# Altium project Cubesat_PDM.PrjPcb (part 1 of 3)
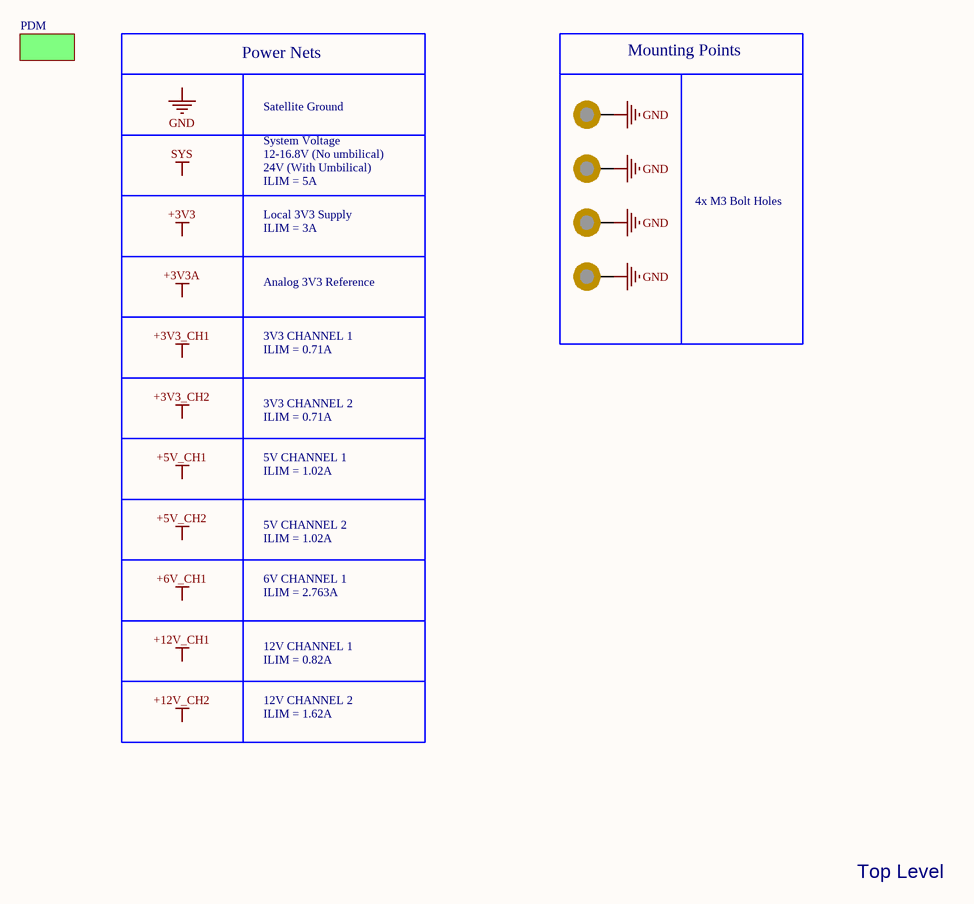
[diagram p0: Top_Level.SchDoc]
Engineer: TH; Engineer_Name: TH; PCB_Name: PDM; Revision: 1
11 sheets, 331 parts. Net scope: flat (ports and power ports of the same name join across sheets).
Board file: PDM.PcbDoc
Sheets:
  Top_Level.SchDoc
    PDM = PDM.SchDoc
      Controller = Controller.SchDoc
        I2C_Buffer = I2C_Buffer.SchDoc
      12V_Supply = 12V_Supply.SchDoc
      3V3_Supply = 3V3_Supply.SchDoc
      5V5_Supply = 6V_Supply.SchDoc
      Ideal_Diode0 = Ideal_Diode.SchDoc
      Ideal_Diode1 = Ideal_Diode.SchDoc
      Ideal_Diode2 = Ideal_Diode.SchDoc
      Ideal_Diode3 = Ideal_Diode.SchDoc
      5V_Supply = 5V_Supply.SchDoc
      Heater_1 = Heater_Driver.SchDoc
      Heater_2 = Heater_Driver.SchDoc
      PC104 = PC104.SchDoc

## Sheet Top_Level.SchDoc
size 297 x 209 mm; SheetNumber: 1; SheetTotal: 11

### Parts
MECH1  M3 Mounting Hole  [M3 Mounting Hole]  (value not drawn)  (no BOM)
MECH2  M3 Mounting Hole  [M3 Mounting Hole]  (value not drawn)  (no BOM)
MECH3  M3 Mounting Hole  [M3 Mounting Hole]  (value not drawn)  (no BOM)
MECH4  M3 Mounting Hole  [M3 Mounting Hole]  (value not drawn)  (no BOM)

### Sub-sheets
PDM = PDM: no entries

### Nets
GND: MECH1.1 MECH2.1 MECH3.1 MECH4.1

### Notes on the sheet
- Power Nets
- Mounting Points
- Satellite Ground
- System Voltage
- 12-16.8V (No umbilical)
- 24V (With Umbilical)
- ILIM = 5A
- Local 3V3 Supply
- ILIM = 3A
- 4x M3 Bolt Holes
- Analog 3V3 Reference
- 3V3 CHANNEL 1
- ILIM = 0.71A
- 3V3 CHANNEL 2
- 5V CHANNEL 1
- ILIM = 1.02A
- 5V CHANNEL 2
- 6V CHANNEL 1
- ILIM = 2.763A
- 12V CHANNEL 1
- ILIM = 0.82A
- 12V CHANNEL 2
- ILIM = 1.62A
- Top Level
- Labels drawn without touching a wire or pin: +3V3, +3V3_CH1, +3V3_CH2, +3V3A, +5V_CH1, +5V_CH2, +6V_CH1, +12V_CH1, +12V_CH2, GND, SYS
- Size:
- Title:
- A4
- Project:
- Rev:
- Date:
- Drawn By:
- Sheet:
- of

## Sheet PDM.SchDoc
size 297 x 209 mm; SheetNumber: 2; SheetTotal: 11
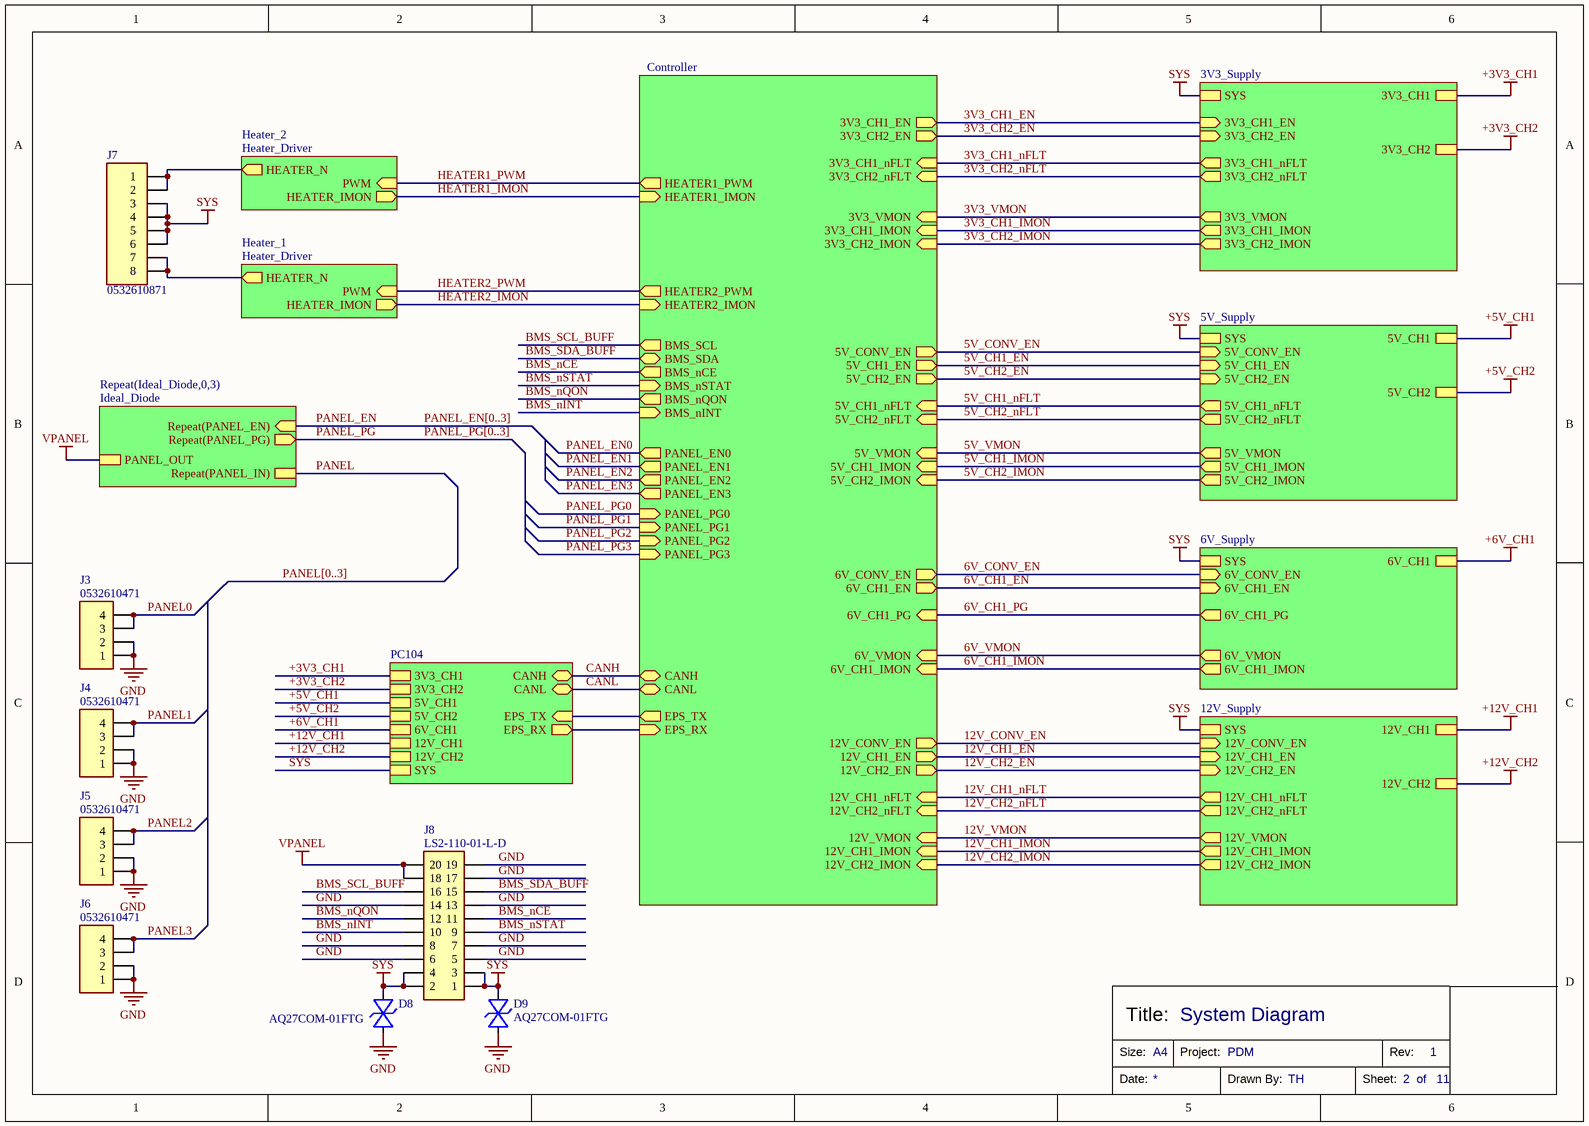
[diagram p1: PDM.SchDoc]

### Parts
D8  AQ27COM-01FTG  [SOD-323]
D9  AQ27COM-01FTG  [SOD-323]
J3  0532610471  [0532610471]
J4  0532610471  [0532610471]
J5  0532610471  [0532610471]
J6  0532610471  [0532610471]
J7  0532610871  [0532610871]
J8  LS2-110-01-L-D  [LS2-110-01-L-D]

### Sub-sheets
3V3_Supply = 3V3_Supply: SYS, 3V3_CH1, 3V3_CH2, 3V3_CH1_EN (in), 3V3_CH2_EN (in), 3V3_CH1_nFLT (out), 3V3_CH2_nFLT (out), 3V3_VMON (out), 3V3_CH1_IMON (out), 3V3_CH2_IMON (out)
5V5_Supply = 6V_Supply: SYS, 6V_CH1, 6V_CONV_EN (in), 6V_CH1_EN (in), 6V_CH1_PG (out), 6V_VMON (out), 6V_CH1_IMON (out)
5V_Supply = 5V_Supply: SYS, 5V_CH1, 5V_CH2, 5V_CONV_EN (in), 5V_CH1_EN (in), 5V_CH2_EN (in), 5V_CH1_nFLT (out), 5V_CH2_nFLT (out), 5V_VMON (out), 5V_CH1_IMON (out), 5V_CH2_IMON (out)
12V_Supply = 12V_Supply: SYS, 12V_CH1, 12V_CH2, 12V_CONV_EN (in), 12V_CH1_EN (in), 12V_CH2_EN (in), 12V_CH1_nFLT (out), 12V_CH2_nFLT (out), 12V_VMON (out), 12V_CH1_IMON (out), 12V_CH2_IMON (out)
Controller = Controller: HEATER1_PWM (out), HEATER1_IMON (in), HEATER2_PWM (out), HEATER2_IMON (in), PANEL_EN3 (out), PANEL_EN2 (out), PANEL_EN1 (out), PANEL_EN0 (out), PANEL_PG0 (in), PANEL_PG1 (in), PANEL_PG2 (in), PANEL_PG3 (in), 3V3_CH1_EN (out), 3V3_CH2_EN (out), 3V3_CH1_nFLT (in), 3V3_CH2_nFLT (in), 3V3_VMON (in), 3V3_CH1_IMON (in), 3V3_CH2_IMON (in), 5V_CONV_EN (out), 5V_CH1_EN (out), 5V_CH2_EN (out), 5V_CH1_nFLT (in), 5V_CH2_nFLT (in), 5V_CH1_IMON (in), 5V_CH2_IMON (in), 6V_CONV_EN (out), 6V_CH1_EN (out), 6V_CH1_PG (in), 6V_VMON (in), 12V_CONV_EN (out), 12V_CH1_EN (out), 12V_CH2_EN (out), 12V_CH1_nFLT (in), 12V_CH2_nFLT (in), 12V_VMON (in), 12V_CH1_IMON (in), 12V_CH2_IMON (in), 5V_VMON (in), 6V_CH1_IMON (in), BMS_SCL (out), BMS_SDA (bidir), BMS_nSTAT (in), BMS_nCE (out), BMS_nQON (out), BMS_nINT (in), CANH (bidir), CANL (bidir), EPS_TX (out), EPS_RX (in)
Heater_1 = Heater_Driver: HEATER_N (out), PWM (in), HEATER_IMON (out)
Heater_2 = Heater_Driver: HEATER_N (out), PWM (in), HEATER_IMON (out)
PC104 = PC104: 3V3_CH1, 3V3_CH2, 5V_CH1, 5V_CH2, 6V_CH1, 12V_CH1, 12V_CH2, CANH (bidir), CANL (bidir), SYS, EPS_TX (in), EPS_RX (out)
Repeat(Ideal_Diode,0,3) = Ideal_Diode: Repeat(PANEL_IN), Repeat(PANEL_EN) (in), Repeat(PANEL_PG) (out), PANEL_OUT

### Nets
+3V3_CH1: sheet 3V3_Supply/3V3_CH1, sheet PC104/3V3_CH1
+3V3_CH2: sheet 3V3_Supply/3V3_CH2, sheet PC104/3V3_CH2
+5V_CH1: sheet 5V_Supply/5V_CH1, sheet PC104/5V_CH1
+5V_CH2: sheet 5V_Supply/5V_CH2, sheet PC104/5V_CH2
+6V_CH1: sheet 5V5_Supply/6V_CH1, sheet PC104/6V_CH1
+12V_CH1: sheet 12V_Supply/12V_CH1, sheet PC104/12V_CH1
+12V_CH2: sheet 12V_Supply/12V_CH2, sheet PC104/12V_CH2
GND: D8.A D9.A J3.1 J3.2 J4.1 J4.2 J5.1 J5.2 J6.1 J6.2 J8.5 J8.6 J8.7 J8.8 J8.13 J8.14 J8.17 J8.19
SYS: D8.K D9.K J7.3 J7.4 J7.5 J7.6 J8.1 J8.2 J8.3 J8.4 ; sheet 12V_Supply/SYS, sheet 3V3_Supply/SYS, sheet 5V5_Supply/SYS, sheet 5V_Supply/SYS, sheet PC104/SYS
VPANEL: J8.18 J8.20 ; sheet Repeat(Ideal_Diode,0,3)/PANEL_OUT
3V3_CH1_EN: sheet Controller/3V3_CH1_EN, sheet 3V3_Supply/3V3_CH1_EN
3V3_CH1_IMON: sheet Controller/3V3_CH1_IMON, sheet 3V3_Supply/3V3_CH1_IMON
3V3_CH1_nFLT: sheet Controller/3V3_CH1_nFLT, sheet 3V3_Supply/3V3_CH1_nFLT
3V3_CH2_EN: sheet Controller/3V3_CH2_EN, sheet 3V3_Supply/3V3_CH2_EN
3V3_CH2_IMON: sheet Controller/3V3_CH2_IMON, sheet 3V3_Supply/3V3_CH2_IMON
3V3_CH2_nFLT: sheet Controller/3V3_CH2_nFLT, sheet 3V3_Supply/3V3_CH2_nFLT
3V3_VMON: sheet Controller/3V3_VMON, sheet 3V3_Supply/3V3_VMON
5V_CH1_EN: sheet Controller/5V_CH1_EN, sheet 5V_Supply/5V_CH1_EN
5V_CH1_IMON: sheet Controller/5V_CH1_IMON, sheet 5V_Supply/5V_CH1_IMON
5V_CH1_nFLT: sheet Controller/5V_CH1_nFLT, sheet 5V_Supply/5V_CH1_nFLT
5V_CH2_EN: sheet Controller/5V_CH2_EN, sheet 5V_Supply/5V_CH2_EN
5V_CH2_IMON: sheet Controller/5V_CH2_IMON, sheet 5V_Supply/5V_CH2_IMON
5V_CH2_nFLT: sheet Controller/5V_CH2_nFLT, sheet 5V_Supply/5V_CH2_nFLT
5V_CONV_EN: sheet Controller/5V_CONV_EN, sheet 5V_Supply/5V_CONV_EN
5V_VMON: sheet Controller/5V_VMON, sheet 5V_Supply/5V_VMON
6V_CH1_EN: sheet Controller/6V_CH1_EN, sheet 5V5_Supply/6V_CH1_EN
6V_CH1_IMON: sheet Controller/6V_CH1_IMON, sheet 5V5_Supply/6V_CH1_IMON
6V_CH1_PG: sheet Controller/6V_CH1_PG, sheet 5V5_Supply/6V_CH1_PG
6V_CONV_EN: sheet Controller/6V_CONV_EN, sheet 5V5_Supply/6V_CONV_EN
6V_VMON: sheet Controller/6V_VMON, sheet 5V5_Supply/6V_VMON
12V_CH1_EN: sheet Controller/12V_CH1_EN, sheet 12V_Supply/12V_CH1_EN
12V_CH1_IMON: sheet Controller/12V_CH1_IMON, sheet 12V_Supply/12V_CH1_IMON
12V_CH1_nFLT: sheet Controller/12V_CH1_nFLT, sheet 12V_Supply/12V_CH1_nFLT
12V_CH2_EN: sheet Controller/12V_CH2_EN, sheet 12V_Supply/12V_CH2_EN
12V_CH2_IMON: sheet Controller/12V_CH2_IMON, sheet 12V_Supply/12V_CH2_IMON
12V_CH2_nFLT: sheet Controller/12V_CH2_nFLT, sheet 12V_Supply/12V_CH2_nFLT
12V_CONV_EN: sheet Controller/12V_CONV_EN, sheet 12V_Supply/12V_CONV_EN
12V_VMON: sheet Controller/12V_VMON, sheet 12V_Supply/12V_VMON
BMS_nCE: J8.11 ; sheet Controller/BMS_nCE
BMS_nINT: J8.10 ; sheet Controller/BMS_nINT
BMS_nQON: J8.12 ; sheet Controller/BMS_nQON
BMS_nSTAT: J8.9 ; sheet Controller/BMS_nSTAT
BMS_SCL_BUFF: J8.16 ; sheet Controller/BMS_SCL
BMS_SDA_BUFF: J8.15 ; sheet Controller/BMS_SDA
CANH: sheet Controller/CANH, sheet PC104/CANH
CANL: sheet Controller/CANL, sheet PC104/CANL
HEATER1_IMON: sheet Controller/HEATER1_IMON, sheet Heater_2/HEATER_IMON
HEATER1_PWM: sheet Controller/HEATER1_PWM, sheet Heater_2/PWM
HEATER2_IMON: sheet Controller/HEATER2_IMON, sheet Heater_1/HEATER_IMON
HEATER2_PWM: sheet Controller/HEATER2_PWM, sheet Heater_1/PWM
PANEL: sheet Repeat(Ideal_Diode,0,3)/Repeat(PANEL_IN)
PANEL0: J3.3 J3.4
PANEL1: J4.3 J4.4
PANEL2: J5.3 J5.4
PANEL3: J6.3 J6.4
PANEL_EN: sheet Repeat(Ideal_Diode,0,3)/Repeat(PANEL_EN)
PANEL_EN0: sheet Controller/PANEL_EN0
PANEL_EN1: sheet Controller/PANEL_EN1
PANEL_EN2: sheet Controller/PANEL_EN2
PANEL_EN3: sheet Controller/PANEL_EN3
PANEL_PG: sheet Repeat(Ideal_Diode,0,3)/Repeat(PANEL_PG)
PANEL_PG0: sheet Controller/PANEL_PG0
PANEL_PG1: sheet Controller/PANEL_PG1
PANEL_PG2: sheet Controller/PANEL_PG2
PANEL_PG3: sheet Controller/PANEL_PG3
NetJ7_1: J7.1 J7.2 ; sheet Heater_2/HEATER_N
NetJ7_7: J7.7 J7.8 ; sheet Heater_1/HEATER_N
(unnamed): sheet Controller/EPS_TX, sheet PC104/EPS_TX
(unnamed): sheet Controller/EPS_RX, sheet PC104/EPS_RX

### Buses and harness runs
bus PANEL[0..3]
bus PANEL_EN[0..3]
bus PANEL_PG[0..3]

### Notes on the sheet
- System Diagram
- Size:
- Title:
- A4
- Project:
- Rev:
- Date:
- Drawn By:
- Sheet:
- of

### Library data of the parts
D8 D9 = AQ27COM-01FTG: Transient Voltage Suppression Diodes - TVS 27V 4A 30kV 12pF SOD323 Diode Array; Clamping Voltage: 50V; Breakdown Voltage: 28V; Vesd: 32kV; Working Voltage: 27V; Ipp - Peak Pulse Current: 4A; Temperature Range: -40~150°C; Part Number: AQ27COM-01FTG; Distributor: Digikey; Distributor Part Number: 18-AQ27COM-01FTGCT-ND
J3-J6 = 0532610471: Connector Header Surface Mount, Right Angle 4 position 0.049" (1.25mm) Molex Picoblade; Number of Positions: 4; Max Current Per Contact: 1A; Part Number: 0532610471; Distributor: Digikey; Distributor Part Number: WM7622CT-ND; Number of Rows: 2
J7 = 0532610871: Connector Header Surface Mount, Right Angle 8 position 0.049" (1.25mm) Picoblade; Number of Positions: 8; Contact Current (Max): 1A; Material Flammability Rating: UL94 V-0; Part Number: 0532610871; Distributor Part Number: WM7624CT-ND; Distributor: Digikey
J8 = LS2-110-01-L-D: Connector Self Mating 20 Position , Non-Gendered, Hermaphroditic Through Hole Gold; Number of Positions: 20; Contact Rating: 3.2A; Voltage Rating: 475VAC; Part Number: LS2-110-01-L-D; Distributor Part Number: SAM9665-ND; Distributor: Digikey; Number of Rows: 2; Operating Temperature: -55C ~ 125C

## Sheet Controller.SchDoc
size 297 x 209 mm; SheetNumber: 4; SheetTotal: 11
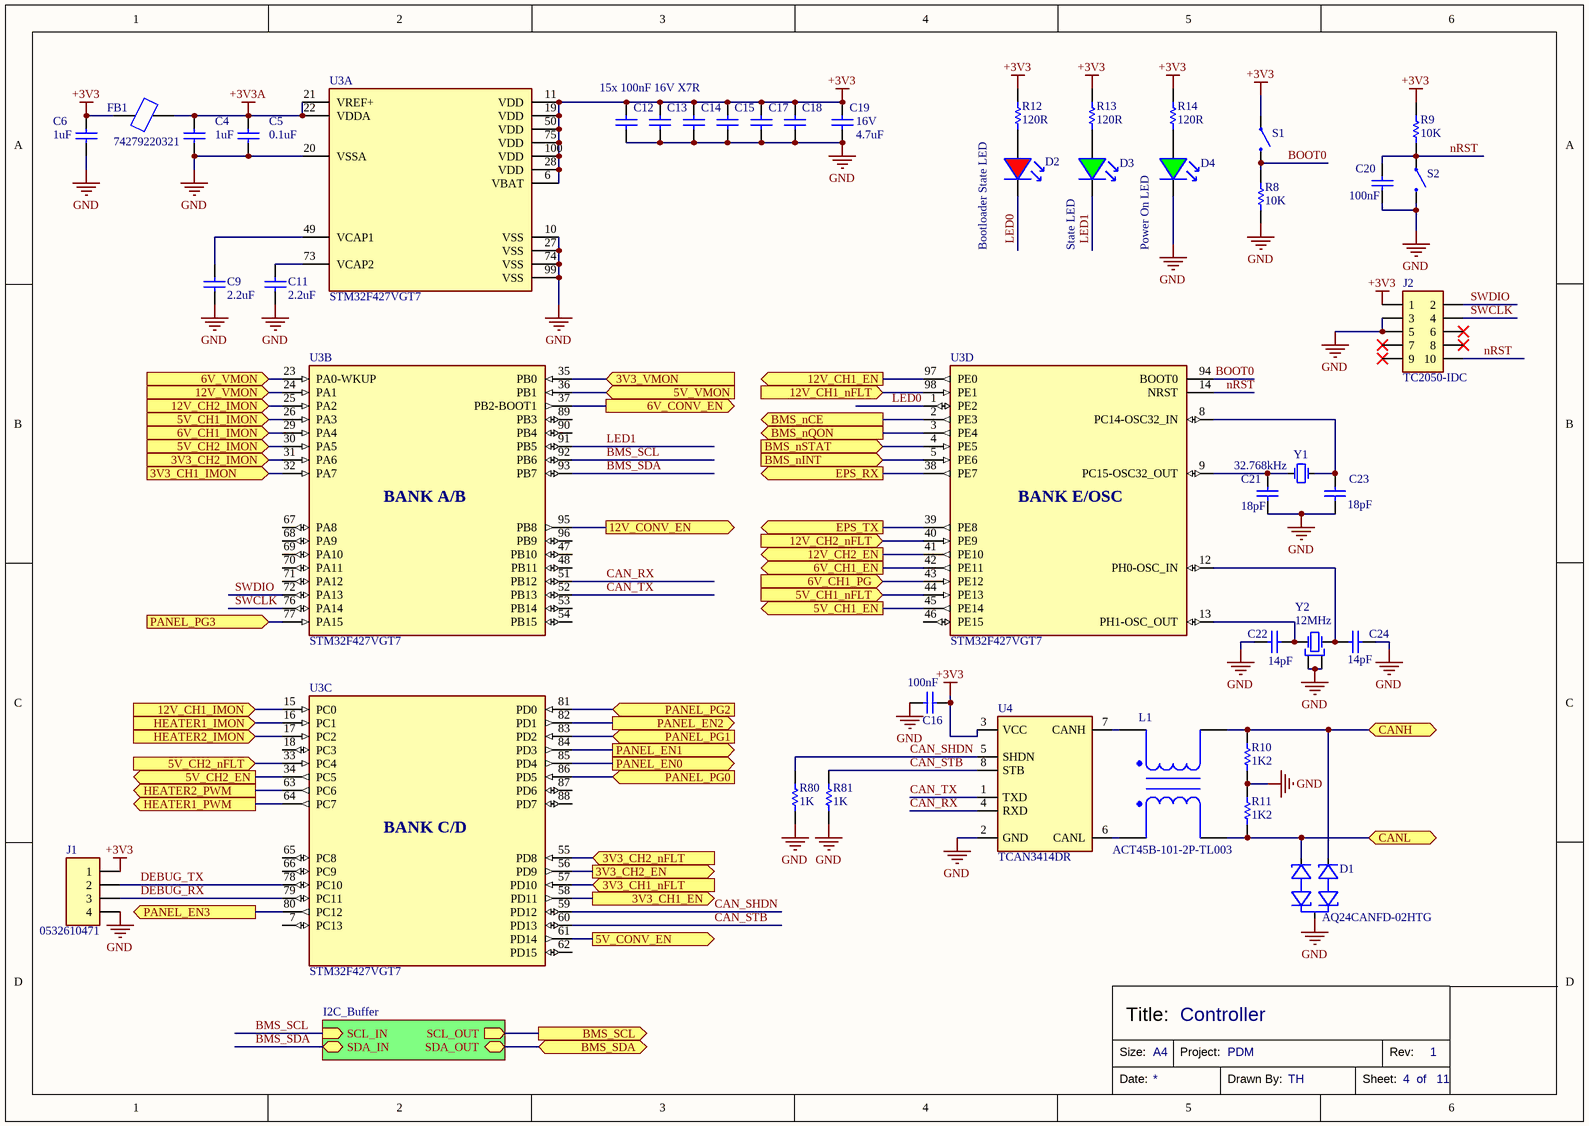
[diagram p2: Controller.SchDoc]

### Parts
C4  Capacitance: 1uF  [CAPC0603X040]  (hidden comment: CL10B105KO8NNNC)
C5  Capacitance: 0.1uF  [CAPC0402X020]  (hidden comment: CL05B104KB5NNNC)
C6  Capacitance: 1uF  [CAPC0603X040]  (hidden comment: CL10B105KO8NNNC)
C9  Capacitance: 2.2uF  [CAPC0805X060]  (hidden comment: CL21A225KBFNNNE)
C11  Capacitance: 2.2uF  [CAPC0805X060]  (hidden comment: CL21A225KBFNNNE)
C12  CL05B104KB5NNNC  [CAPC0402X020]  (value not drawn)
C13  CL05B104KB5NNNC  [CAPC0402X020]  (value not drawn)
C14  CL05B104KB5NNNC  [CAPC0402X020]  (value not drawn)
C15  CL05B104KB5NNNC  [CAPC0402X020]  (value not drawn)
C16  Capacitance: 100nF  [CAPC0603X040]  (hidden comment: C0603C104K5RACTU)
C17  CL05B104KB5NNNC  [CAPC0402X020]  (value not drawn)
C18  CL05B104KB5NNNC  [CAPC0402X020]  (value not drawn)
C19  Voltage Rating: 16V  Capacitance: 4.7uF  [CAPC0805X060]  (hidden comment: CL21B475KOFNFNE)
C20  Capacitance: 100nF  [CAPC0603X040]  (hidden comment: C0603C104K5RACTU)
C21  Capacitance: 18pF  [CAPC0402X020]  (hidden comment: KGM05ACG1H180FH)
C22  Capacitance: 14pF  [CAPC0402X020]  (hidden comment: GJM1555C1H140FB01D)
C23  Capacitance: 18pF  [CAPC0402X020]  (hidden comment: KGM05ACG1H180FH)
C24  Capacitance: 14pF  [CAPC0402X020]  (hidden comment: GJM1555C1H140FB01D)
D1  AQ24CANFD-02HTG  [SOT23-3 IC]
D2  LTST-C170EKT  [LEDR_0805]  (value not drawn)
D3  LTST-C170GKT  [LEDG_0805]  (value not drawn)
D4  LTST-C170GKT  [LEDG_0805]  (value not drawn)
FB1  74279220321  [74279220321]
J1  0532610471  [0532610471]
J2  TC2050-IDC  [TC2050-IDC]  (no BOM)
L1  ACT45B-101-2P-TL003  [ACT45B-101-2P-TL003]
R8  Resistance: 10K  [RESC0805]  (hidden comment: RMCF0805FT10K0)
R9  Resistance: 10K  [RESC0805]  (hidden comment: RMCF0805FT10K0)
R10  Resistance: 1K2  [RESC0603]  (hidden comment: RMCF0603FT1K20)
R11  Resistance: 1K2  [RESC0603]  (hidden comment: RMCF0603FT1K20)
R12  Resistance: 120R  [RESC0805]  (hidden comment: RMCF0805FT120R)
R13  Resistance: 120R  [RESC0805]  (hidden comment: RMCF0805FT120R)
R14  Resistance: 120R  [RESC0805]  (hidden comment: RMCF0805FT120R)
R80  Resistance: 1K  [RESC0805]  (hidden comment: RNCP0805FTD1K00)
R81  Resistance: 1K  [RESC0805]  (hidden comment: RNCP0805FTD1K00)
S1  B3U-1000P  [B3U-1000P]  (value not drawn)
S2  B3U-1000P  [B3U-1000P]  (value not drawn)
U3  STM32F427VGT7  [STM32F427VGT7]  (parts A,B,C,D of 4)
U4  TCAN3414DR  [SOIC-8]
Y1  Frequency: 32.768kHz  [CM7VT1A32.768KHZ125PF20PPMTBQAT3]  (hidden comment: CM7VT1A32.768KHZ125PF20PPMTBQAT3)
Y2  Frequency: 12MHz  [830069882]  (hidden comment: 830069882)

### Sub-sheets
I2C_Buffer = I2C_Buffer: SCL_IN (in), SDA_IN (bidir), SCL_OUT (out), SDA_OUT (bidir)

### Ports
3V3_CH1_EN (out, see PDM[4A], 3V3_Supply[4B]), 3V3_CH1_IMON (in, see PDM[4A], 3V3_Supply[2D]), 3V3_CH1_nFLT (in, see PDM[4A], 3V3_Supply[4B]), 3V3_CH2_EN (out, see PDM[4A], 3V3_Supply[4C]), 3V3_CH2_IMON (in, see PDM[4A], 3V3_Supply[5D]), 3V3_CH2_nFLT (in, see PDM[4A], 3V3_Supply[4C]), 3V3_VMON (in, see PDM[4A], 3V3_Supply[2C]), 5V_CH1_EN (out, see PDM[4B], 5V_Supply[4B]), 5V_CH1_IMON (in, see PDM[4B], 5V_Supply[2D]), 5V_CH1_nFLT (in, see PDM[4B], 5V_Supply[4B]), 5V_CH2_EN (out, see PDM[4B], 5V_Supply[4C]), 5V_CH2_IMON (in, see PDM[4B], 5V_Supply[4D]), 5V_CH2_nFLT (in, see PDM[4B], 5V_Supply[4C]), 5V_CONV_EN (out, see PDM[4B], 5V_Supply[1B]), 5V_VMON (in, see PDM[4B], 5V_Supply[2C]), 6V_CH1_EN (out, see PDM[4C], 6V_Supply[3C]), 6V_CH1_IMON (in, see PDM[4C], 6V_Supply[2D]), 6V_CH1_PG (in, see PDM[4C], 6V_Supply[4C]), 6V_CONV_EN (out, see PDM[4C], 6V_Supply[1B]), 6V_VMON (in, see PDM[4C], 6V_Supply[2C]), 12V_CH1_EN (out, see PDM[4C], 12V_Supply[4B]), 12V_CH1_IMON (in, see PDM[4D], 12V_Supply[2D]), 12V_CH1_nFLT (in, see PDM[4C], 12V_Supply[4B]), 12V_CH2_EN (out, see PDM[4C], 12V_Supply[4C]), 12V_CH2_IMON (in, see PDM[4D], 12V_Supply[4D]), 12V_CH2_nFLT (in, see PDM[4C], 12V_Supply[4C]), 12V_CONV_EN (out, see PDM[4C], 12V_Supply[1B]), 12V_VMON (in, see PDM[4C], 12V_Supply[2C]), BMS_nCE (out, see PDM[3B]), BMS_nINT (in, see PDM[3B]), BMS_nQON (out, see PDM[3B]), BMS_nSTAT (in, see PDM[3B]), BMS_SCL (out, see PDM[3B]), BMS_SDA (bidir, see PDM[3B]), CANH (bidir, see PDM[3C], PC104[2B]), CANL (bidir, see PDM[3C], PC104[2B]), EPS_RX (out, see PDM[3C], PC104[3B]), EPS_TX (out, see PDM[3C], PC104[3B]), HEATER1_IMON (in, see PDM[3A]), HEATER1_PWM (out, see PDM[3A]), HEATER2_IMON (in, see PDM[3B]), HEATER2_PWM (out, see PDM[3B]), PANEL_EN0 (out, see PDM[3B]), PANEL_EN1 (out, see PDM[3B]), PANEL_EN2 (out, see PDM[3B]), PANEL_EN3 (out, see PDM[3B]), PANEL_PG0 (in, see PDM[3B]), PANEL_PG1 (in, see PDM[3B]), PANEL_PG2 (in, see PDM[3B]), PANEL_PG3 (in, see PDM[3B])

### Nets
+3V3: C6.2 C12.2 C13.2 C14.2 C15.2 C16.2 C17.2 C18.2 C19.2 FB1.1 J1.1 J2.1 R9.2 R12.2 R13.2 R14.2 S1.1 U3.6(VBAT) U3.11(VDD) U3.19(VDD) U3.28(VDD) U3.50(VDD) U3.75(VDD) U3.100(VDD) U4.3(VCC)
+3V3A: C4.2 C5.2 FB1.2 U3.21(VREF+) U3.22(VDDA)
GND: C4.1 C5.1 C6.1 C9.1 C11.1 C12.1 C13.1 C14.1 C15.1 C16.1 C17.1 C18.1 C19.1 C20.1 C21.1 C22.1 C23.2 C24.1 D1.3 D4.K J1.4 J2.3 J2.5 R8.1 R10.1 R11.2 R80.1 R81.1 S2.2 U3.10(VSS) U3.20(VSSA) U3.27(VSS) U3.74(VSS) U3.99(VSS) U4.2(GND) Y2.2(OSC1) Y2.4(OSC1)
BMS_SCL: U3.92(PB6) ; sheet I2C_Buffer/SCL_IN
BMS_SDA: U3.93(PB7) ; sheet I2C_Buffer/SDA_IN
BOOT0: R8.2 S1.2 U3.94(BOOT0)
CAN_RX: U3.51(PB12) U4.4(RXD)
CAN_SHDN: R80.2 U3.59(PD12) U4.5(SHDN)
CAN_STB: R81.2 U3.60(PD13) U4.8(STB)
CAN_TX: U3.52(PB13) U4.1(TXD)
CANH: D1.1 L1.4 R10.2 ; port CANH
CANL: D1.2 L1.3 R11.1 ; port CANL
DEBUG_RX: J1.3 U3.79(PC11)
DEBUG_TX: J1.2 U3.78(PC10)
EPS_RX/OBC_TX: U3.38(PE7) ; port EPS_RX
EPS_TX/OBC_RX: U3.39(PE8) ; port EPS_TX
LED0: D2.K U3.1(PE2)
LED1: D3.K U3.91(PB5)
nRST: C20.2 J2.10 R9.1 S2.1 U3.14(NRST)
SWCLK: J2.4 U3.76(PA14)
SWDIO: J2.2 U3.72(PA13)
NetC7_2: U3.32(PA7) ; port 3V3_CH1_IMON
NetC8_2: U3.31(PA6) ; port 3V3_CH2_IMON
NetC9_2: C9.2 U3.49(VCAP1)
NetC10_2: U3.29(PA4) ; port 6V_CH1_IMON
NetC11_2: C11.2 U3.73(VCAP2)
NetC21_2: C21.2 U3.9(PC15-OSC32_OUT) Y1.1(OSC1)
NetC22_2: C22.2 U3.13(PH1-OSC_OUT) Y2.1(OSC1)
NetC23_1: C23.1 U3.8(PC14-OSC32_IN) Y1.2(OSC2)
NetC24_2: C24.2 U3.12(PH0-OSC_IN) Y2.3(OSC2)
NetC91_2: U3.15(PC0) ; port 12V_CH1_IMON
NetC92_2: U3.25(PA2) ; port 12V_CH2_IMON
NetC93_2: U3.26(PA3) ; port 5V_CH1_IMON
NetC94_2: U3.30(PA5) ; port 5V_CH2_IMON
NetD2_A: D2.A R12.1
NetD3_A: D3.A R13.1
NetD4_A: D4.A R14.1
NetL1_1: L1.1 U4.7(CANH)
NetL1_2: L1.2 U4.6(CANL)
NetR30_2: U3.42(PE11) ; port 6V_CH1_EN
NetR37_1: U3.43(PE12) ; port 6V_CH1_PG
NetR84_2: U3.37(PB2-BOOT1) ; port 6V_CONV_EN
NetR86_2: U3.95(PB8) ; port 12V_CONV_EN
NetR87_2: U3.61(PD14) ; port 5V_CONV_EN
NetR88_2: U3.97(PE0) ; port 12V_CH1_EN
NetR89_2: U3.41(PE10) ; port 12V_CH2_EN
NetR90_2: U3.45(PE14) ; port 5V_CH1_EN
NetR91_2: U3.34(PC5) ; port 5V_CH2_EN
NetR92_2: U3.58(PD11) ; port 3V3_CH1_EN
NetR93_2: U3.56(PD9) ; port 3V3_CH2_EN
NetU3_2: U3.2(PE3) ; port BMS_nCE
NetU3_3: U3.3(PE4) ; port BMS_nQON
NetU3_4: U3.4(PE5) ; port BMS_nSTAT
NetU3_5: U3.5(PE6) ; port BMS_nINT
NetU3_16: U3.16(PC1) ; port HEATER1_IMON
NetU3_17: U3.17(PC2) ; port HEATER2_IMON
NetU3_23: U3.23(PA0-WKUP) ; port 6V_VMON
NetU3_24: U3.24(PA1) ; port 12V_VMON
NetU3_33: U3.33(PC4) ; port 5V_CH2_nFLT
NetU3_35: U3.35(PB0) ; port 3V3_VMON
NetU3_36: U3.36(PB1) ; port 5V_VMON
NetU3_40: U3.40(PE9) ; port 12V_CH2_nFLT
NetU3_44: U3.44(PE13) ; port 5V_CH1_nFLT
NetU3_55: U3.55(PD8) ; port 3V3_CH2_nFLT
NetU3_57: U3.57(PD10) ; port 3V3_CH1_nFLT
NetU3_63: U3.63(PC6) ; port HEATER2_PWM
NetU3_64: U3.64(PC7) ; port HEATER1_PWM
NetU3_77: U3.77(PA15) ; port PANEL_PG3
NetU3_80: U3.80(PC12) ; port PANEL_EN3
NetU3_81: U3.81(PD0) ; port PANEL_PG2
NetU3_82: U3.82(PD1) ; port PANEL_EN2
NetU3_83: U3.83(PD2) ; port PANEL_PG1
NetU3_84: U3.84(PD3) ; port PANEL_EN1
NetU3_85: U3.85(PD4) ; port PANEL_EN0
NetU3_86: U3.86(PD5) ; port PANEL_PG0
NetU3_98: U3.98(PE1) ; port 12V_CH1_nFLT
(unnamed): port BMS_SCL, sheet I2C_Buffer/SCL_OUT
(unnamed): port BMS_SDA, sheet I2C_Buffer/SDA_OUT

Not connected (* = marked no-connect by the designer): J2 6* 7* 8* 9*; U3 7(PC13) 18(PC3) 46(PE15) 47(PB10) 48(PB11) 53(PB14) 54(PB15) 62(PD15) 65(PC8) 66(PC9) 67(PA8) 68(PA9) 69(PA10) 70(PA11) 71(PA12) 87(PD6) 88(PD7) 89(PB3) 90(PB4) 96(PB9)

### Notes on the sheet
- 15x 100nF 16V X7R
- Bootloader State LED
- (near D3) State LED
- (near D4) Power On LED
- Controller
- Size:
- Title:
- A4
- Project:
- Rev:
- Date:
- Drawn By:
- Sheet:
- of
- (in symbol STM32F427VGT7, part B) BANK A/B
- (in symbol STM32F427VGT7, part C) BANK C/D
- (in symbol STM32F427VGT7, part D) BANK E/OSC

### Library data of the parts
C4 C6 = CAPC0603: 1 µF ±10% 16V Ceramic Capacitor X7R 0603 (1608 Metric); Manufacturer Part Number: CL10B105KO8NNNC; Tolerance: 10%; Distributor Part number: 1276-1019-1-ND; Case Code: 0603; Voltage Rating: 16V; Distributor: Digikey
C5 = CL05B104KB5NNNC: 0.1 µF ±10% 50V Ceramic Capacitor X7R 0402 (1005 Metric); Part Number: CL05B104KB5NNNC; Tolerance: 10%; Distributor Part Number: 1276-CL05B104KB5NNNCCT-ND; Case Code: 0402; Distributor: Digikey; Voltage Rating: 50V
C9 C11 = CL21A225KBFNNNE: 2.2uF ±10% 25V Ceramic Capacitor X7R 0805 (2012 Metric); Part Number: CL21A225KBFNNNE; Distributor Part Number: 1276-6702-1-ND; Tolerance: 10%; Case Code: 0805; Distributor: Digikey; Voltage Rating: 25V
C12-C15 C17 C18 = CL05B104KB5NNNC: 0.1 µF ±10% 50V Ceramic Capacitor X7R 0402 (1005 Metric); Capacitance: 0.1uF; Part Number: CL05B104KB5NNNC; Tolerance: 10%; Distributor Part Number: 1276-CL05B104KB5NNNCCT-ND; Case Code: 0402; Distributor: Digikey; Voltage Rating: 50V
C16 C20 = C0603C104K5RACTU: 0.1 µF ±10% 50V Ceramic Capacitor X7R 0603 (1608 Metric); Tolerance: 10%; Distributor Part Number: 399-C0603C104K5RACTUCT-ND; Case Code: 0603; Voltage Rating: 50V; Distributor: Digikey; Part Number: C0603C104K5RACTU
C19 = CL21B475KOFNFNE: 4.7 µF ±10% 16V Ceramic Capacitor X7R 0805 (2012 Metric); Distributor Part Number: 1276-2970-1-ND; Tolerance: 10%; Case Code: 0805; Distributor: Digikey; Part Number: CL21B475KOFNFNE
C21 C23 = CAPC0402: 18 pF ±1% 50V Ceramic Capacitor C0G, NP0 0402 (1005 Metric); Manufacturer Part Number: KGM05ACG1H180FH; Tolerance: 1%; Distributor Part Number: 478-KGM05ACG1H180FHCT-ND; Case Code: 0402; Distributor: Digikey; Voltage Rating: 50V
C22 C24 = CAPC0402: 14 pF ±1% 50V Ceramic Capacitor C0G, NP0 0402 (1005 Metric); Manufacturer Part Number: GJM1555C1H140FB01D; Tolerance: 1%; Distributor Part Number: 2266-GJM1555C1H140FB01DTR-ND; Case Code: 0402; Distributor: Digikey; Voltage Rating: 50V
D1 = AQ24CANFD-02HTG: 50V Clamp 3A (8/20µs) Ipp Tvs Diode Surface Mount SOT-23-3; Qualification: AEC-Q101; Voltage - Reverse Standoff (Typ): 24V; Voltage - Breakdown (Min): 26.7V; Power - Peak Pulse: 200W; Capacitance: 11.5pF @ 1MHz; Part Number: AQ24CANFD-02HTG; Distributor Part Number: F10993CT-ND; Distributor: Digikey; Operating Temperature: -40°C ~ 150°C; Voltage - Clamping (Max): 50V; Current - Peak Pulse (10us/1000us): 3A
D2 = LEDR0805: Red 621nm LED Indication - Discrete 2V 0805 (2012 Metric); Manufacturer Part Number: LTST-C170EKT; Distributor Part Number: 160-1178-1-ND; Colour: Red; Operating Temperature: *; Distributor: Digikey
D3 D4 = LEDG0805: Green 569nm LED Indication - Discrete 2.1V 0805 (2012 Metric); Manufacturer Part Number: LTST-C170GKT; Distributor Part Number: 160-1179-1-ND; Colour: Green; Operating Temperature: *; Distributor: Digikey
FB1 = 74279220321: Ferrite Bead 320 Ohms @ 100 MHz 1 Ferrite Bead 0805 (2012 Metric) 2.5A 50mOhm; Part Number: 74279220321; Distributor Part Number: 732-6125-1-ND; Distributor: Digikey; Operating Temperature: -55°C ~ 125°C; Impedance: 320 Ohms @ 100 MHz; Current Rating: 2.5A; DCR: 50mOhm
J1 = 0532610471: as J3 on sheet PDM; Part Number: 0532610471; Distributor: Digikey; Distributor Part Number: WM7622CT-ND; Number of Rows: 2
J2 = TC2050-IDC: JTAG Pogo Programmer Pads; Programmer Part Number: TC2050-IDC
L1 = ACT45B-101-2P-TL003: Common Mode Choke 100 µH @ 100 kHz 2 Line Surface Mount 5.8 kOhms @ 10 MHz 150mA DCR 2Ohm; Inductance: 100uH @ 100kHz; Voltage Rating (DC): 50V; Qualification: AEC-Q200; Part Number: ACT45B-101-2P-TL003; Distributor: Digikey; Distributor Part Number: 445-3959-1-ND; Impedance: 5.8kohms @ 10MHz; Current Rating (Max): 150mA; DCR: 2Ohm; Operating Temperature: -40°C ~ 150°C
R8 R9 = RMCF0805FT10K0: 10 kOhms ±1% 0.125W, 1/8W Chip Resistor 0805 (2012 Metric) Automotive AEC-Q200 Thick Film; Tolerance: 1%; Distributor Part Number: RMCF0805FT10K0CT-ND; Case Code: 0805; Distributor: Digikey; Part Number: RMCF0805FT10K0
R10 R11 = RMCF0603FT1K20: 1.2 kOhms ±1% 0.1W, 1/10W Chip Resistor 0603 (1608 Metric) Automotive AEC-Q200 Thick Film; Part Number: RMCF0603FT1K20; Tolerance: 1%; Distributor: Digikey; Distributor Part Number: RMCF0603FT1K20CT-ND; Case Code: 0603
R12-R14 = RMCF0805FT120R: 120 Ohms ±1% 0.125W, 1/8W Chip Resistor 0805 (2012 Metric) Automotive AEC-Q200 Thick Film; Part Number: RMCF0805FT120R; Tolerance: 1%; Distributor Part Number: 738-RMCF0805FT120RCT-ND; Distributor: Digikey; Case Code: 0805
R80 R81 = RNCP0805FTD1K00: 1 kOhms ±1% 0.25W, 1/4W Chip Resistor 0805 (2012 Metric) Anti-Sulfur Thin Film; Manufacturer Part Number: RNCP0805FTD1K00; Tolerance: 1%; Distributor Part Number: RNCP0805FTD1K00CT-ND; Distributor: Digikey; Case Code: 0805
S1 S2 = B3U-1000P: Tactile Switch SPST-NO Top Actuated Surface Mount; Part Number: B3U-1000P; Distributor: Digikey; Distributor Part Number: SW1020CT-ND; Operating Temperature: -25°C ~ 70°C
U3 = STM32F427VGT7: ARM® Cortex®-M4 STM32F4 Microcontroller IC 32-Bit 180MHz 1MB (1M x 8) FLASH 100-LQFP (14x14); RAM Size: 256Kx8; Voltage - Supply: 1.8V ~ 3.6V; Part Number: STM32F427VGT7; Distributor Part Number: 497-16769-ND; Distributor: Digikey; Operating Temperature: -40°C ~ 105°C (TA); Speed: 180MHz
U4 = TCAN3414DR: 3.3 V CAN-FD transceiver, CAN/CAN-FD up to 8 Mb/s, ±58 V bus-fault tolerant, SOIC-8; Voltage - Supply: 3V ~ 3.6V; Data Rate: 8Mbps; Protocol: CANbus; Part Number: TCAN3414DR; Distributor: Digikey; Distributor Part Number: 296-TCAN3414DRCT-ND; Operating Temperature: -40°C ~ 125°C
Y1 = CM7VT1A32.768KHZ125PF20PPMTBQAT3: CRYSTAL 32.7680KHZ 12.5PF SMD; Qualification: AEC-Q200; ESR: 70kohm; Part Number: CM7VT1A32.768KHZ125PF20PPMTBQAT3; Distributor Part Number: 2195-CM7VT1A32.768KHZ125PF20PPMTBQAT3CT-ND; Distributor: Digikey; Operating Temperature: -40°C ~ 125°C; Load Capacitance: 12.5pF
Y2 = 830069882: Crystals 12.0 MHZ 18PF 20PPM 120OHM; Load Capacitance: 10pF; ESR: 100R; Distributor Part Number: 732-830069882CT-ND; Part Number: 830069882; Operating Temperature: -40C to 125C; Distributor: Digikey

## Sheet I2C_Buffer.SchDoc
size 297 x 209 mm; SheetNumber: 5; SheetTotal: 11
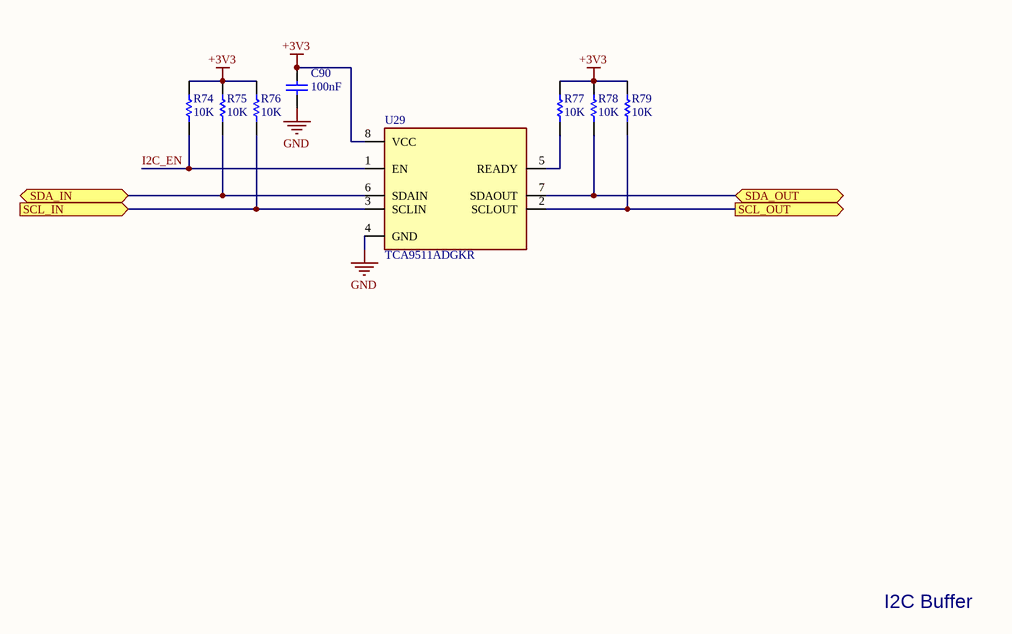
[diagram p3: I2C_Buffer.SchDoc]

### Parts
C90  Capacitance: 100nF  [CAPC0603X040]  (hidden comment: C0603C104K5RACTU)
R74  Resistance: 10K  [RESC0603]  (hidden comment: RMCF0603FT10K0)
R75  Resistance: 10K  [RESC0603]  (hidden comment: RMCF0603FT10K0)
R76  Resistance: 10K  [RESC0603]  (hidden comment: RMCF0603FT10K0)
R77  Resistance: 10K  [RESC0603]  (hidden comment: RMCF0603FT10K0)
R78  Resistance: 10K  [RESC0603]  (hidden comment: RMCF0603FT10K0)
R79  Resistance: 10K  [RESC0603]  (hidden comment: RMCF0603FT10K0)
U29  TCA9511ADGKR  [VSSOP-8]

### Ports
SCL_IN (in, see Controller[2D]), SCL_OUT (out, see Controller[2D]), SDA_IN (bidir, see Controller[2D]), SDA_OUT (bidir, see Controller[2D])

### Nets
+3V3: C90.2 R74.2 R75.2 R76.2 R77.2 R78.2 R79.2 U29.8(VCC)
GND: C90.1 U29.4(GND)
I2C_EN: R74.1 U29.1(EN)
NetR75_1: R75.1 U29.6(SDAIN) ; port SDA_IN
NetR76_1: R76.1 U29.3(SCLIN) ; port SCL_IN
NetR77_1: R77.1 U29.5(READY)
NetR78_1: R78.1 U29.7(SDAOUT) ; port SDA_OUT
NetR79_1: R79.1 U29.2(SCLOUT) ; port SCL_OUT

### Notes on the sheet
- I2C Buffer
- Size:
- Title:
- A4
- Project:
- Rev:
- Date:
- Drawn By:
- Sheet:
- of

### Library data of the parts
C90 = C0603C104K5RACTU: as C16 on sheet Controller; Tolerance: 10%; Distributor Part Number: 399-C0603C104K5RACTUCT-ND; Case Code: 0603; Voltage Rating: 50V; Distributor: Digikey; Part Number: C0603C104K5RACTU
R74-R79 = RMCF0603FT10K0: 10 kOhms ±1% 0.1W, 1/10W Chip Resistor 0603 (1608 Metric) Automotive AEC-Q200 Thick Film; Part Number: RMCF0603FT10K0; Tolerance: 1%; Distributor: Digikey; Distributor Part Number: RMCF0603FT10K0CT-ND; Case Code: 0603
U29 = TCA9511ADGKR: Hot-swappable, bidirectional I²C/SMBus bus buffer, 1 V precharge, standard/fast I²C, clock stretching, arbitration, and powered-off high-impedance on bus pins.; Delay Time: 70ns; Part Number: TCA9511ADGKR; Distributor: Digikey; Distributor Part Number: 296-TCA9511ADGKRCT-ND; Operating Temperature: -40°C ~ 125°C

## Sheet 12V_Supply.SchDoc
size 297 x 209 mm; SheetNumber: 8; SheetTotal: 11
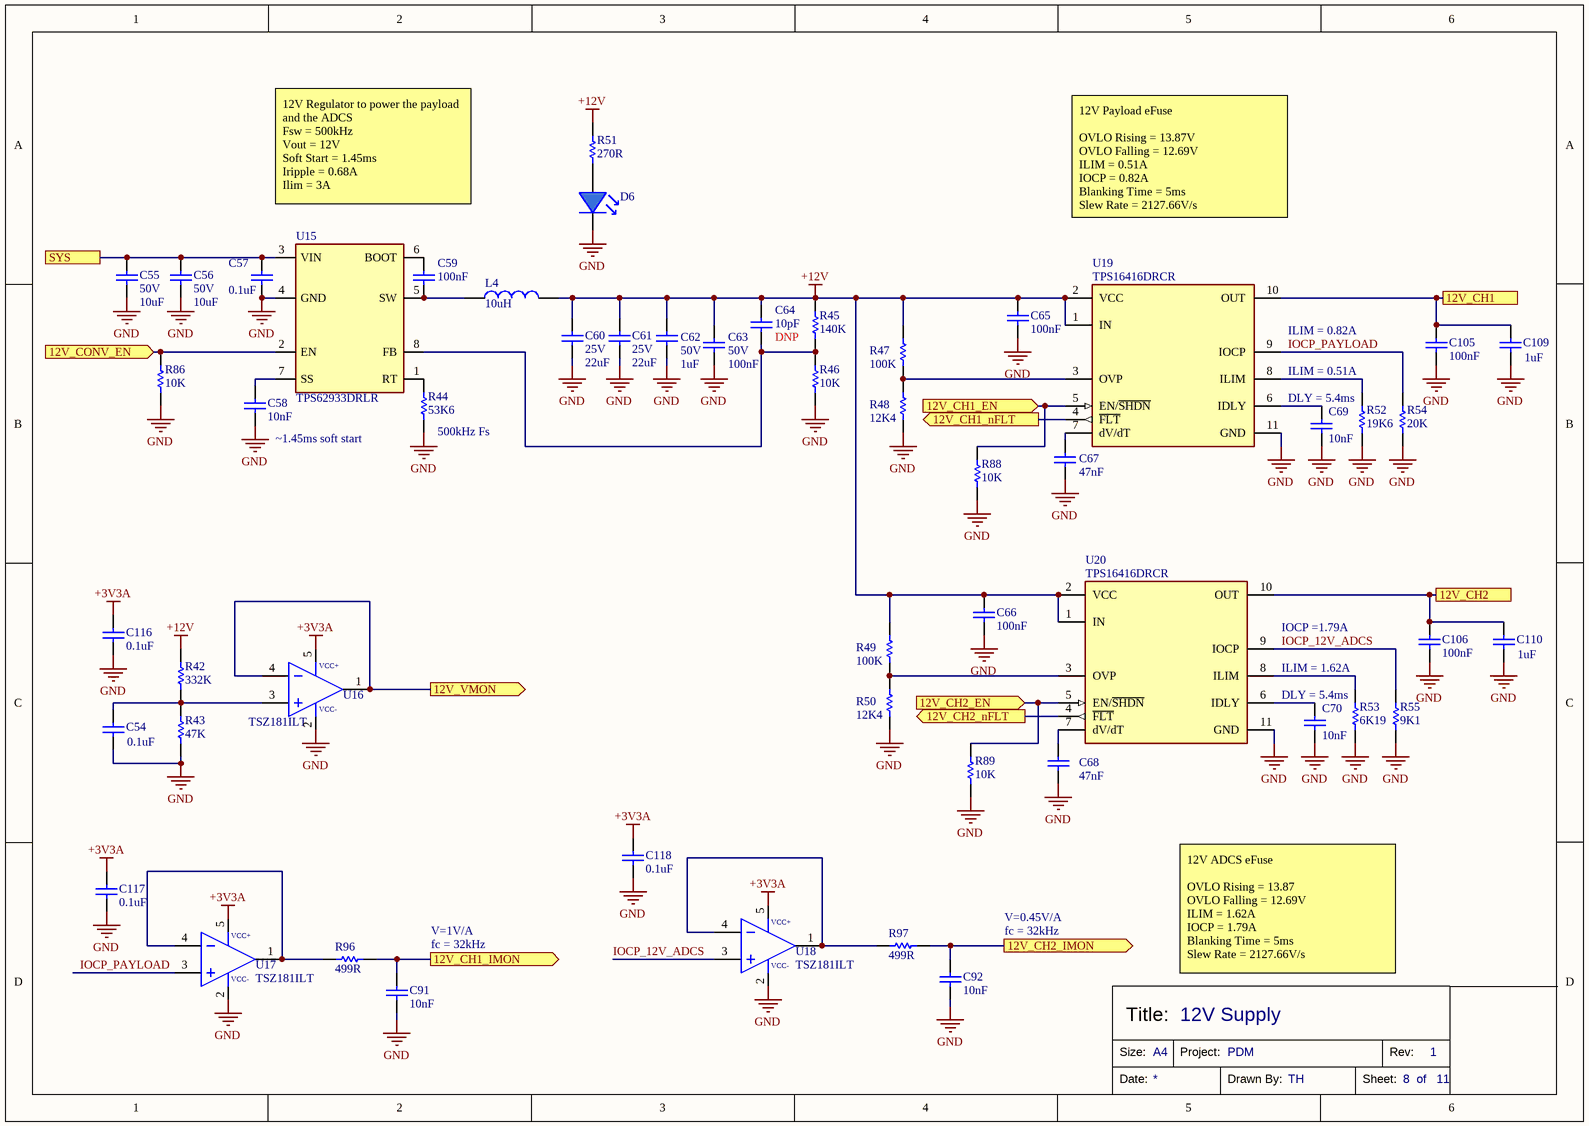
[diagram p4: 12V_Supply.SchDoc]

### Parts
C54  Capacitance: 0.1uF  [CAPC0805X060]  (hidden comment: CL21B104KACNNNC)
C55  Voltage Rating: 50V  Capacitance: 10uF  [CAPC1210X090]  (hidden comment: CL32B106KBJNNNE)
C56  Voltage Rating: 50V  Capacitance: 10uF  [CAPC1210X090]  (hidden comment: CL32B106KBJNNNE)
C57  Capacitance: 0.1uF  [CAPC0402X020]  (hidden comment: CL05B104KB5NNNC)
C58  Capacitance: 10nF  [CAPC0805X060]  (hidden comment: CL21B103KBANNNC)
C59  Capacitance: 100nF  [CAPC0603X040]  (hidden comment: C0603C104K5RACTU)
C60  Voltage Rating: 25V  Capacitance: 22uF  [CAPC1210X090]  (hidden comment: CL32B226KAJNNNE)
C61  Voltage Rating: 25V  Capacitance: 22uF  [CAPC1210X090]  (hidden comment: CL32B226KAJNNNE)
C62  Voltage Rating: 50V  Capacitance: 1uF  [CAPC0805X060]  (hidden comment: CL21B105KBFNNNE)
C63  Voltage Rating: 50V  Capacitance: 100nF  [CAPC0603X040]  (hidden comment: C0603C104K5RACTU)
C64  Capacitance: 10pF  [CAPC0603X040]  (hidden comment: C0603C104K5RACTU)
C65  Capacitance: 100nF  [CAPC0603X040]  (hidden comment: C0603C104K5RACTU)
C66  Capacitance: 100nF  [CAPC0603X040]  (hidden comment: C0603C104K5RACTU)
C67  Capacitance: 47nF  [CAPC0805X060]  (hidden comment: CL21B473KBCNNNC)
C68  Capacitance: 47nF  [CAPC0805X060]  (hidden comment: CL21B473KBCNNNC)
C69  Capacitance: 10nF  [CAPC0805X060]  (hidden comment: CL21B103KBANNNC)
C70  Capacitance: 10nF  [CAPC0805X060]  (hidden comment: CL21B103KBANNNC)
C91  Capacitance: 10nF  [CAPC0805X060]  (hidden comment: CL21B103KBANNNC)
C92  Capacitance: 10nF  [CAPC0805X060]  (hidden comment: CL21B103KBANNNC)
C105  Capacitance: 100nF  [CAPC0603X040]  (hidden comment: C0603C104K5RACTU)
C106  Capacitance: 100nF  [CAPC0603X040]  (hidden comment: C0603C104K5RACTU)
C109  Capacitance: 1uF  [CAPC0805X060]  (hidden comment: CL21B105KAFNNNE)
C110  Capacitance: 1uF  [CAPC0805X060]  (hidden comment: CL21B105KAFNNNE)
C116  Capacitance: 0.1uF  [CAPC0603X040]  (hidden comment: C0603C104K5RACTU)
C117  Capacitance: 0.1uF  [CAPC0603X040]  (hidden comment: C0603C104K5RACTU)
C118  Capacitance: 0.1uF  [CAPC0603X040]  (hidden comment: C0603C104K5RACTU)
D6  LSM0805463V  [LEDB_0805]  (value not drawn)
L4  Inductance: 10uH  [1274AS-H-100M=P3]  (hidden comment: 1274AS-H-100M=P3)
R42  Resistance: 332K  [RESC0805]  (hidden comment: RMCF0805FT332K)
R43  Resistance: 47K  [RESC0805]  (hidden comment: RMCF0805FT47K0)
R44  Resistance: 53K6  [RESC0805]  (hidden comment: RMCF0805FT53K6)
R45  Resistance: 140K  [RESC0603]  (hidden comment: RMCF0603FT140K)
R46  Resistance: 10K  [RESC0603]  (hidden comment: RMCF0603FT10K0)
R47  Resistance: 100K  [RESC0805]  (hidden comment: RMCF0805FG100K)
R48  Resistance: 12K4  [RESC0805]  (hidden comment: RMCF0805FT12K4)
R49  Resistance: 100K  [RESC0805]  (hidden comment: RMCF0805FG100K)
R50  Resistance: 12K4  [RESC0805]  (hidden comment: RMCF0805FT12K4)
R51  Resistance: 270R  [RESC0805]  (hidden comment: RMCF0805FT270R)
R52  Resistance: 19K6  [RESC0805]  (hidden comment: RMCF0805FT19K6)
R53  Resistance: 6K19  [RESC0805]  (hidden comment: RMCF0805FT6K19)
R54  Resistance: 20K  [RESC0805]  (hidden comment: RMCF0805FT20K0)
R55  Resistance: 9K1  [RESC0805]  (hidden comment: RMCF0805FT9K10)
R86  Resistance: 10K  [RESC0805]  (hidden comment: RMCF0805FT10K0)
R88  Resistance: 10K  [RESC0805]  (hidden comment: RMCF0805FT10K0)
R89  Resistance: 10K  [RESC0805]  (hidden comment: RMCF0805FT10K0)
R96  Resistance: 499R  [RESC0805]  (hidden comment: RMCF0805FT499R)
R97  Resistance: 499R  [RESC0805]  (hidden comment: RMCF0805FT499R)
U15  TPS62933DRLR  [SOT-583]
U16  TSZ181ILT  [SOT23-5 IC]
U17  TSZ181ILT  [SOT23-5 IC]
U18  TSZ181ILT  [SOT23-5 IC]
U19  Part Number: TPS16416DRCR  [TPS1641]  (hidden comment: TPS16410DRCR)
U20  Part Number: TPS16416DRCR  [TPS1641]  (hidden comment: TPS16410DRCR)

### Ports
12V_CH1 (see PDM[6C]), 12V_CH1_EN (in, see PDM[5C], Controller[3B]), 12V_CH1_IMON (out, see PDM[5D], Controller[1C]), 12V_CH1_nFLT (out, see PDM[5C], Controller[3B]), 12V_CH2 (see PDM[6C]), 12V_CH2_EN (in, see PDM[5C], Controller[3B]), 12V_CH2_IMON (out, see PDM[5D], Controller[1B]), 12V_CH2_nFLT (out, see PDM[5C], Controller[3B]), 12V_CONV_EN (in, see PDM[5C], Controller[3B]), 12V_VMON (out, see PDM[5C], Controller[1B]), SYS (see PDM[5C], 3V3_Supply[1B], 5V_Supply[1A], 6V_Supply[1B], PC104[4C], PC104[5C])

### Nets
+3V3A: C116.2 C117.2 C118.2 U16.5(VCC+) U17.5(VCC+) U18.5(VCC+)
+12V: C60.2 C61.2 C62.2 C63.2 C64.2 C65.2 C66.2 L4.2 R42.2 R45.2 R47.2 R49.2 R51.2 U19.1(IN) U19.2(VCC) U20.1(IN) U20.2(VCC)
GND: C54.1 C55.1 C56.1 C57.1 C58.1 C60.1 C61.1 C62.1 C63.1 C65.1 C66.1 C67.1 C68.1 C69.1 C70.1 C91.1 C92.1 C105.1 C106.1 C109.1 C110.1 C116.1 C117.1 C118.1 D6.K R43.1 R44.1 R46.1 R48.1 R50.1 R52.1 R53.1 R54.1 R55.1 R86.1 R88.1 R89.1 U15.4(GND) U16.2(VCC-) U17.2(VCC-) U18.2(VCC-) U19.11(GND) U20.11(GND)
IOCP_12V_ADCS: R55.2 U18.3(IN+) U20.9(IOCP)
IOCP_PAYLOAD: R54.2 U17.3(IN+) U19.9(IOCP)
NetC26_2: C55.2 C56.2 C57.2 U15.3(VIN) ; port SYS
NetC54_2: C54.2 R42.1 R43.2 U16.3(IN+)
NetC58_2: C58.2 U15.7(SS)
NetC59_1: C59.1 L4.1 U15.5(SW)
NetC59_2: C59.2 U15.6(BOOT)
NetC64_1: C64.1 R45.1 R46.2 U15.8(FB)
NetC67_2: C67.2 U19.7(dV/dT)
NetC68_2: C68.2 U20.7(dV/dT)
NetC69_2: C69.2 U19.6(IDLY)
NetC70_2: C70.2 U20.6(IDLY)
NetC91_2: C91.2 R96.2 ; port 12V_CH1_IMON
NetC92_2: C92.2 R97.2 ; port 12V_CH2_IMON
NetC105_2: C105.2 C109.2 U19.10(OUT) ; port 12V_CH1
NetC106_2: C106.2 C110.2 U20.10(OUT) ; port 12V_CH2
NetD6_A: D6.A R51.1
NetR44_2: R44.2 U15.1(RT)
NetR47_1: R47.1 R48.2 U19.3(OVP)
NetR49_1: R49.1 R50.2 U20.3(OVP)
NetR52_2: R52.2 U19.8(ILIM)
NetR53_2: R53.2 U20.8(ILIM)
NetR86_2: R86.2 U15.2(EN) ; port 12V_CONV_EN
NetR88_2: R88.2 U19.5(EN/~{SHDN}) ; port 12V_CH1_EN
NetR89_2: R89.2 U20.5(EN/~{SHDN}) ; port 12V_CH2_EN
NetR96_1: R96.1 U17.1(OUT) U17.4(IN-)
NetR97_1: R97.1 U18.1(OUT) U18.4(IN-)
NetU3_24: U16.1(OUT) U16.4(IN-) ; port 12V_VMON
NetU3_40: U20.4(~{FLT}) ; port 12V_CH2_nFLT
NetU3_98: U19.4(~{FLT}) ; port 12V_CH1_nFLT

### Notes on the sheet
- 12V Regulator to power the payload and the ADCS
  Fsw = 500kHz
  Vout = 12V
  Soft Start = 1.45ms
  Iripple = 0.68A
  Ilim = 3A
- 12V Payload eFuse
  OVLO Rising = 13.87V
  OVLO Falling = 12.69V
  ILIM = 0.51A
  IOCP = 0.82A
  Blanking Time = 5ms
  Slew Rate = 2127.66V/s
- DNP
- (near U19) ILIM = 0.82A
- DLY = 5.4ms
- ILIM = 0.51A
- ~1.45ms soft start
- (near R44) 500kHz Fs
- ILIM = 1.62A
- (near U20) IOCP =1.79A
- V=1V/A
- V=0.45V/A
- fc = 32kHz
- 12V ADCS eFuse
  OVLO Rising = 13.87
  OVLO Falling = 12.69V
  ILIM = 1.62A
  IOCP = 1.79A
  Blanking Time = 5ms
  Slew Rate = 2127.66V/s
- 12V Supply
- Size:
- Title:
- A4
- Project:
- Rev:
- Date:
- Drawn By:
- Sheet:
- of

### Library data of the parts
C54 = CL21B104KACNNNC: 0.1uF ±10% 25V Ceramic Capacitor X7R 0805 (2012 Metric); Part Number: CL21B104KACNNNC; Distributor Part Number: 1276-1099-1-ND; Tolerance: 10%; Case Code: 0805; Distributor: Digikey; Voltage Rating: 25V
C55 C56 = CL32B106KBJNNNE: 10 µF ±10% 50V Ceramic Capacitor X7R 1210 (3225 Metric); Manufacturer Part Number: CL32B106KBJNNNE; Distributor Part Number: 1276-3387-1-ND; Tolerance: 10%; Case Code: 1210; Distributor: Digikey
C57 = CL05B104KB5NNNC: as C5 on sheet Controller; Part Number: CL05B104KB5NNNC; Tolerance: 10%; Distributor Part Number: 1276-CL05B104KB5NNNCCT-ND; Case Code: 0402; Distributor: Digikey; Voltage Rating: 50V
C58 C69 C70 C91 C92 = CL21B103KBANNNC: 10nF ±10% 50V Ceramic Capacitor X7R 0805 (2012 Metric); Voltage Rating: 25V; Part Number: CL21B103KBANNNC; Distributor Part Number: 1276-1015-1-ND; Tolerance: 10%; Case Code: 0805; Distributor: Digikey
C59 C63 C65 C66 C105 C106 C116-C118 = C0603C104K5RACTU: as C16 on sheet Controller; Distributor Part Number: 399-C0603C104K5RACTUCT-ND; Tolerance: 10%; Case Code: 0603; Distributor: Digikey
  C59: Manufacturer Part Number: C0603C104K5RACTU; Voltage Rating: 50V
  C63: Part Number: C0603C104K5RACTU
  C65 C66 C105 C106 C116-C118: Part Number: C0603C104K5RACTU; Voltage Rating: 50V
C60 C61 = CL32B226KAJNNNE: 22 µF ±10% 25V Ceramic Capacitor X7R 1210 (3225 Metric); Part Number: CL32B226KAJNNNE; Distributor Part Number: 1276-3392-1-ND; Tolerance: 10%; Case Code: 1210; Distributor: Digikey
C62 = CL21B105KBFNNNE: 1uF 50V X7R ±10% 0805 Multilayer Ceramic Capacitors MLCC - SMD/SMT ROHS; Part Number: CL21B105KBFNNNE; Distributor Part Number: 1276-1029-1-ND; Tolerance: 10%; Case Code: 0805; Distributor: Digikey
C64 = C0603C100J5GACTU: 10 pF ±5% 50V Ceramic Capacitor C0G, NP0 0603 (1608 Metric); Tolerance: 10%; Part Number: C0603C100J5GACTU; Distributor Part Number: 399-C0603C100J5GACTUCT-ND; Case Code: 0603; Distributor: Digikey; Voltage Rating: 50V
C67 C68 = CL21B473KBCNNNC: 0.047 µF ±10% 50V Ceramic Capacitor X7R 0805 (2012 Metric); Voltage Rating: 25V; Part Number: CL21B473KBCNNNC; Distributor Part Number: 1276-1250-1-ND; Tolerance: 10%; Case Code: 0805; Distributor: Digikey
C109 C110 = CL21B105KAFNNNE: 1uF ±10% 25V Ceramic Capacitor X7R 0805 (2012 Metric); Part Number: CL21B105KAFNNNE; Distributor Part Number: 1276-1066-1-ND; Tolerance: 10%; Case Code: 0805; Distributor: Digikey; Voltage Rating: 25V
D6 = LEDB0805: Blue 469nm LED Indication - Discrete 3V 0805 (2012 Metric); Manufacturer Part Number: LSM0805463V; Distributor Part Number: 28-LSM0805463VCT-ND; Colour: Blue; Operating Temperature: *; Voltage - Forward: 3V; Distributor: Digikey
L4 = 1274AS-H-100M=P3: Inductor 10 µH , 4.4 A 30.4mOhm Max Shielded Drum Core; Current Rating: 4.4A; Saturation Current: 6.2A; Part Number: 1274AS-H-100M=P3; Distributor Part Number: 490-10846-1-ND; Distributor: Digikey; DCR: 30.4mOhm
R42 = RMCF0805FT332K: 332 kOhms ±1% 0.125W, 1/8W Chip Resistor 0805 (2012 Metric) Automotive AEC-Q200 Thick Film; Part Number: RMCF0805FT332K; Tolerance: 1%; Distributor Part Number: RMCF0805FT332KCT-ND; Distributor: Digikey; Case Code: 0805
R43 = RMCF0805FT47K0: 47 kOhms ±1% 0.125W, 1/8W Chip Resistor 0805 (2012 Metric) Automotive AEC-Q200 Thick Film; Part Number: RMCF0805FT47K0; Tolerance: 1%; Distributor Part Number: RMCF0805FT47K0CT-ND; Distributor: Digikey; Case Code: 0805
R44 = RMCF0805FT53K6: 53.6 kOhms ±1% 0.125W, 1/8W Chip Resistor 0805 (2012 Metric) Automotive AEC-Q200 Thick Film; Part Number: RMCF0805FT53K6; Tolerance: 1%; Distributor Part Number: RMCF0805FT53K6CT-ND; Distributor: Digikey; Case Code: 0805
R45 = RMCF0603FT140K: 140 kOhms ±1% 0.1W, 1/10W Chip Resistor 0603 (1608 Metric) Automotive AEC-Q200 Thick Film; Part Number: RMCF0603FT100K; Tolerance: 1%; Distributor: Digikey; Distributor Part Number: RMCF0603FT140KCT-ND; Case Code: 0603
R46 = RMCF0603FT10K0: as R74 on sheet I2C_Buffer; Tolerance: 1%; Distributor Part Number: RMCF0603FT10K0CT-ND; Distributor: Digikey; Case Code: 0603; Part Number: RMCF0603FT10K0
R47 R49 = RMCF0805FG100K: 100 kOhms ±1% 0.125W, 1/8W Chip Resistor 0805 (2012 Metric) Automotive AEC-Q200 Thick Film; Part Number: RMCF0805FG100K; Tolerance: 1%; Distributor Part Number: RMCF0805FG100KCT-ND; Distributor: Digikey; Case Code: 0805
R48 R50 = RMCF0805FT12K4: 12.4 kOhms ±1% 0.125W, 1/8W Chip Resistor 0805 (2012 Metric) Automotive AEC-Q200 Thick Film; Part Number: RMCF0805FT12K4; Tolerance: 1%; Distributor Part Number: RMCF0805FT12K4CT-ND; Distributor: Digikey; Case Code: 0805
R51 = RMCF0805FT270R: 270 Ohms ±1% 0.125W, 1/8W Chip Resistor 0805 (2012 Metric) Automotive AEC-Q200 Thick Film; Part Number: RMCF0805FT270R; Tolerance: 1%; Distributor Part Number: RMCF0805FT270RCT-ND; Distributor: Digikey; Case Code: 0805
R52 = RMCF0805FT19K6: 19.6 kOhms ±1% 0.125W, 1/8W Chip Resistor 0805 (2012 Metric) Automotive AEC-Q200 Thick Film; Part Number: RMCF0805FT19K6; Tolerance: 1%; Distributor Part Number: RMCF0805FT19K6CT-ND; Distributor: Digikey; Case Code: 0805
R53 = RMCF0805FT6K19: 6.19 kOhms ±1% 0.125W, 1/8W Chip Resistor 0805 (2012 Metric) Automotive AEC-Q200 Thick Film; Part Number: RMCF0805FT6K19; Tolerance: 1%; Distributor Part Number: RMCF0805FT6K19CT-ND; Distributor: Digikey; Case Code: 0805
R54 = RMCF0805FT20K0: 20 kOhms ±1% 0.125W, 1/8W Chip Resistor 0805 (2012 Metric) Automotive AEC-Q200 Thick Film; Part Number: RMCF0805FT20K0; Tolerance: 1%; Distributor Part Number: RMCF0805FT20K0CT-ND; Distributor: Digikey; Case Code: 0805
R55 = RMCF0805FT9K10: 9.1 kOhms ±1% 0.125W, 1/8W Chip Resistor 0805 (2012 Metric) Automotive AEC-Q200 Thick Film; Part Number: RMCF0805FT9K10; Tolerance: 1%; Distributor Part Number: 738-RMCF0805FT9K10CT-ND; Distributor: Digikey; Case Code: 0805
R86 R88 R89 = RMCF0805FT10K0: as R8 on sheet Controller; Part Number: RMCF0805FT10K0; Tolerance: 1%; Distributor Part Number: RMCF0805FT10K0CT-ND; Distributor: Digikey; Case Code: 0805
R96 R97 = RMCF0805FT499R: 499 Ohms ±1% 0.125W, 1/8W Chip Resistor 0805 (2012 Metric) Automotive AEC-Q200 Thick Film; Part Number: RMCF0805FT499R; Tolerance: 1%; Distributor Part Number: RMCF0805FT499RCT-ND; Distributor: Digikey; Case Code: 0805
U15 = TPS62933DRLR: Buck Switching Regulator IC Positive Adjustable 0.8V 1 Output 3A SOT-583; Voltage - Input (Min): 3.8V; Voltage - Input (Max): 30V; Voltage - Output (Max): 22V; Part Number: TPS62933DRLR; Distributor Part Number: 296-TPS62933DRLRCT-ND; Distributor: Digikey; Operating Temperature: -40°C ~ 150°C (TJ); Current Output: 3A; Voltage - Output (Min): 0.8V
U16-U18 = TSZ181ILT: Operational Amplifier, General Purpose, 2.2V~5.5V; Voltage Supply (Min): 2.2V; Voltage Supply (Max): 5.5V; Slew Rate: 4.7V/us; Gain Bandwidth Product: 3MHz; Part Number: TSZ181ILT; Distributor: Digikey; Distributor Part Number: 497-18084-1-ND; Operating Temperature: -40°C ~ 125°C
U19 U20 = TPS16410DRCR: 2.7-V to 40-V 152-mΩ 1.8-A eFuse with output power limiting; Qualification: None; Current - Output: 1.8A; Voltage - Input: 2.7V ~ 40V; Distributor Part Number: 296-TPS16410DRCRCT-ND; Package: 10-VSON (3x3); Distributor: Digikey; Operating Temperature: -40C ~ 125C